# Altium schematic sheet Large_Connector.SchDoc
size A4; SheetNumber: 7; SheetTotal: 10
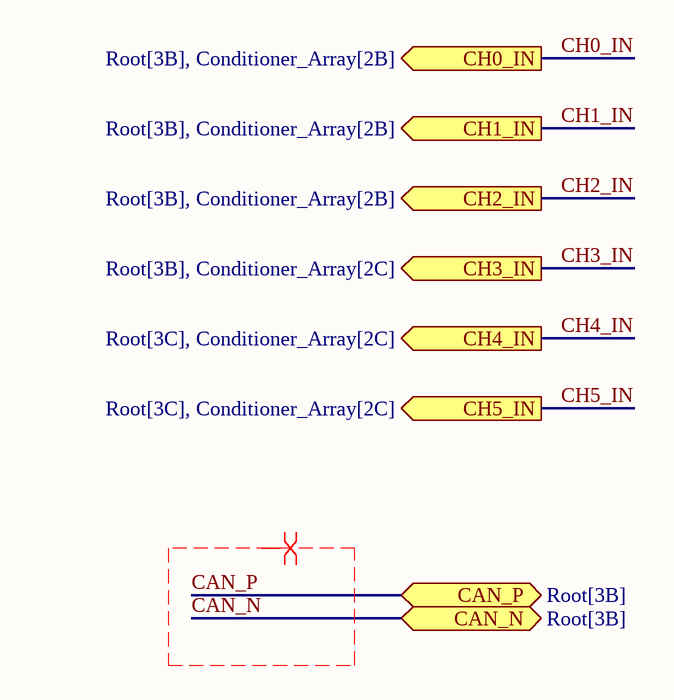
[diagram p0: Large_Connector.SchDoc]

## Ports
CAN_N (bidir, see Root[3B]), CAN_P (bidir, see Root[3B]), CH0_IN (out, see Root[3B], Conditioner_Array[2B]), CH1_IN (out, see Root[3B], Conditioner_Array[2B]), CH2_IN (out, see Root[3B], Conditioner_Array[2B]), CH3_IN (out, see Root[3B], Conditioner_Array[2C]), CH4_IN (out, see Root[3C], Conditioner_Array[2C]), CH5_IN (out, see Root[3C], Conditioner_Array[2C])

## Nets
CAN_N: port CAN_N
CAN_P: port CAN_P
CH0_IN: port CH0_IN
CH1_IN: port CH1_IN
CH2_IN: port CH2_IN
CH3_IN: port CH3_IN
CH4_IN: port CH4_IN
CH5_IN: port CH5_IN

## Layout directives
differential pair: CAN_N, CAN_P